# Altium schematic sheet 3xOuts.SchDoc
size A4; SheetNumber: 5; SheetTotal: 6
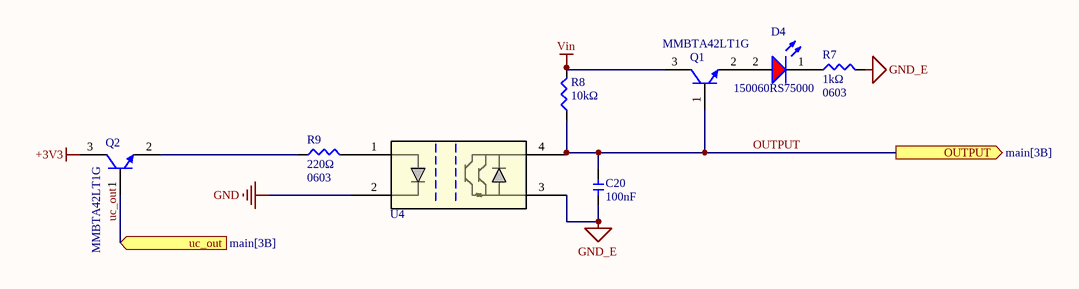
[diagram p0: 3xOuts.SchDoc]

## Parts
C20  value 100nF  [0603_cap]  (hidden comment: 0603_100nF)
D4  150060RS75000  [WL-SMCW_0603_150060xx75000]
Q1  MMBTA42LT1G  [ONSC-SOT-23-3-318-08_V]
Q2  MMBTA42LT1G  [ONSC-SOT-23-3-318-08_V]
R7  value 1kΩ  Package: 0603  [0603-smd]  (hidden comment: 0603_1K)
R8  value 10kΩ  [0603-smd]  (hidden comment: 0603_10K)
R9  value 220Ω  Package: 0603  [0603-smd]  (hidden comment: 0603_220R)
U4  LTV-352T  [IC4_LTV-352T_LTO-M]  (value not drawn)

## Ports
OUTPUT (out, see main[3B]), uc_out (in, see main[3B])

## Nets
+3V3: Q2.3(C)
GND: U4.2
GND_E: C20.1 R7.2 U4.3
Vin: Q1.3(C) R8.2
OUTPUT: C20.2 Q1.1(B) R8.1 U4.4 ; port OUTPUT
uc_out: Q2.1(B) ; port uc_out
NetD4_1: D4.1(K) R7.1
NetD4_2: D4.2(A) Q1.2(E)
NetQ2_2: Q2.2(E) R9.1
NetR9_2: R9.2 U4.1

## Notes on the sheet
- Title:
- Drawn By:
- Page Contents:
- Size:
- Date:
- License:
- Email:
- A4
- Number:
- Time:
- Revision:
- Sheet
- of

## Library data of the parts
C20 = 0603_100nF: Volt: V; Package: 0603
D4 = CMP-1426-00001-3: NexarPartId: 29717776; Color: Red; Power Dissipation: 72mW; Max Reverse Voltage (DC): 5V; Peak Wavelength: 630nm; Viewing Angle: 140°; Forward Voltage: 2V; Luminous Intensity: 250mcd; Forward Current: 100mA; Dominant Wavelength: 625nm; Lens Style: Clear, Rectangular; Max Junction Temperature (Tj): 95°C; Test Current: 20mA; Mount: Surface Mount; Packaging: Tape and Reel; Case Code (Metric): 1608; Max Operating Temperature: 85°C; Case Code (Imperial): 0603; REACH SVHC: Unknown; Width: 800µm; Length: 1.6mm; Reverse Voltage: 5V; Height: 700µm; Case/Package: 0603; RoHS: Compliant; Wavelength: 625nm; Min Operating Temperature: -40°C
Q1 Q2 = CMP-1048-00662-1: High Voltage Transistor, NPN Silicon, 3-Pin SOT-23, Pb-Free, Tape and Reel; Manufacturer: On Semiconductor; fT Min (MHz): 50; IC Continuous (A): 0.5; ComponentLink1URL: http://www.onsemi.com/; ComponentLink3URL: http://www.onsemi.cn/pub_link/Collateral/318-08.PDF; RoHS: TRUE; ComponentLink2Description: Datasheet; PartNumber: MMBTA42LT1G; Polarity: NPN; DatasheetVersion: Rev. 12; PackageReference: SOT-23-3-318-08; PackageDescription: 3-Pin Small Outline Transistor, Body 2.92 x 1.3 mm, Pitch 0.95 mm; ComponentLink3Description: Package Specification; ComponentLink1Description: Manufacturer URL; Packing: Tape and Reel; PackageVersion: Rev. AP, 11/2009; Mounting Technology: Surface Mount; ComponentLink2URL: http://www.onsemi.cn/pub_link/Collateral/MMBTA42LT1-D.PDF
R7 = 0603_1K: Power: W
R8 = 0603_10K: Power: W; Package: 0603
R9 = 0603_220R: Power: W
U4 = LTV-352T: LTV Series Single Channel 300V 3750 Vrms Transistor Output Optocoupler SMT DIP-4; Mfr_Name: LITE-ON; Manufacturer: Vishay Lite-On; RefDes: RefDes; Type: Type; Supplier 1: Rs; Manufacturer Part Number: LTV-352T; RoHS: Yes; Category: Optocouplers; Stock 1: 22730; Pricing 1: 25=0,29, 50=0,278, 250=0,228, 500=0,2 (GBP); ComponentLink1URL: https://datasheet.ciiva.com/11772/0900766b80de6aef-11772096.pdf?src-supplier=Rs; ComponentLink1Description: https://datasheet.ciiva.com/11772/0900766b80de6aef-11772096.pdf?src-supplier=Rs; ComponentLink2URL: https://datasheet.ciiva.com/2086/ltv-352t-2086258.pdf?src-supplier=Digikey; ComponentLink2Description: https://datasheet.ciiva.com/2086/ltv-352t-2086258.pdf?src-supplier=Digikey; ComponentLink3URL: https://datasheet.ciiva.com/19471/1260710-19471302.pdf?src-supplier=Jameco; ComponentLink3Description: https://datasheet.ciiva.com/19471/1260710-19471302.pdf?src-supplier=Jameco; ComponentLink4URL: https://datasheet.ciiva.com/15118/getdatasheetpartid-145582-15118811.pdf?src-supplier=Verical; ComponentLink4Description: https://datasheet.ciiva.com/15118/getdatasheetpartid-145582-15118811.pdf?src-supplier=Verical; ComponentLink5URL: https://datasheet.ciiva.com/2086/s-110-ltv-352t20140520-2086259.pdf?src-supplier=Digikey; ComponentLink5Description: https://datasheet.ciiva.com/2086/s-110-ltv-352t20140520-2086259.pdf?src-supplier=Digikey; ComponentLink6URL: https://datasheet.ciiva.com/2086/s-110-ltv-352t20140520-2086260.pdf?src-supplier=Digikey; ComponentLink6Description: https://datasheet.ciiva.com/2086/s-110-ltv-352t20140520-2086260.pdf?src-supplier=Digikey; Supplier Part Number 1: 6912063P